# Altium schematic sheet TemperatureSensor.SchDoc: Temperature Sensor
size A4; DrawnBy: Patrik Staudenmayer; DocumentNumber: 8; SheetNumber: 8; SheetTotal: 15
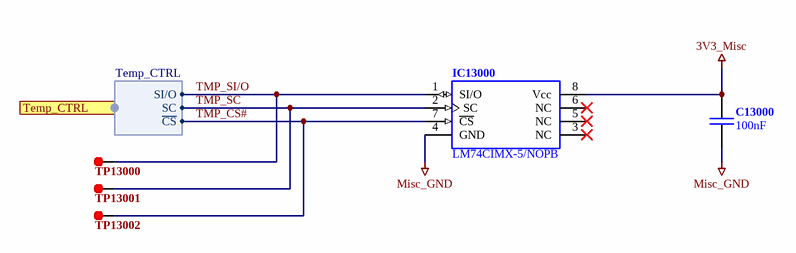
[diagram p0: TemperatureSensor.SchDoc]

## Parts
C13000  100nF  [C_0603_N [CAPC1608N IPC]]
IC13000  LM74CIMX-5/NOPB  [SOIC127P600X175-8N IPC]
TP13000  TP_GENERIC  [TP_0.8_P100T]  (value not drawn)  (no BOM)
TP13001  TP_GENERIC  [TP_0.8_P100T]  (value not drawn)  (no BOM)
TP13002  TP_GENERIC  [TP_0.8_P100T]  (value not drawn)  (no BOM)

## Ports
Temp_CTRL (in, harness Temp_CTRL)

## Harnesses
Temp_CTRL: SI/O, SC, ~{CS}

## Nets
3V3_Misc: C13000.1 IC13000.8(Vcc)
Misc_GND: C13000.2 IC13000.4(GND)
TMP_CS#: IC13000.7(~{CS}) TP13002.1 ; port Temp_CTRL.~{CS}
TMP_SC: IC13000.2(SC) TP13001.1 ; port Temp_CTRL.SC
TMP_SI/O: IC13000.1(SI/O) TP13000.1 ; port Temp_CTRL.SI/O

Not connected (* = marked no-connect by the designer): IC13000 3(NC)* 5(NC)* 6(NC)*

## Notes on the sheet
- Project:
- Title:
- Size:
- Date:
- A4
- Project ID:
- Time:
- Sheet
- Version:
- of
- Variant:
- File:

## Library data of the parts
C13000 = C_GENERIC: Prometheus_ID: *; Prometheus_ManPartNo: 100nF; Prometheus_Manufacturer: *; Prometheus_Comment: 100nF; Prometheus_CurrentFootprint: C_0603_N [CAPC1608N IPC]
IC13000 = IC_LM74CIMX-5/NOPB: SPI 12-Bit Plus Sign Temperature Sensor / 0.0625°C Temperature Resolution; Prometheus_Manufacturer: Texas Instruments; Prometheus_ManPartNo: LM74CIMX-5/NOPB; Prometheus_Comment: LM74CIMX-5/NOPB; Prometheus_CurrentFootprint: SOIC127P600X175-8N IPC; DatasheetURL: https://www.ti.com/lit/ds/symlink/lm74.pdf
TP13000-TP13002 = TP_GENERIC: Needle Test Point; Prometheus_ID: *; Prometheus_ManPartNo: TP_GENERIC; Prometheus_Manufacturer: *; Prometheus_Comment: TP_GENERIC; Prometheus_CurrentFootprint: TP_0.8_P100T